# Altium schematic sheet Antenna & RF.SchDoc
size A4; SheetNumber: 2; SheetTotal: 2
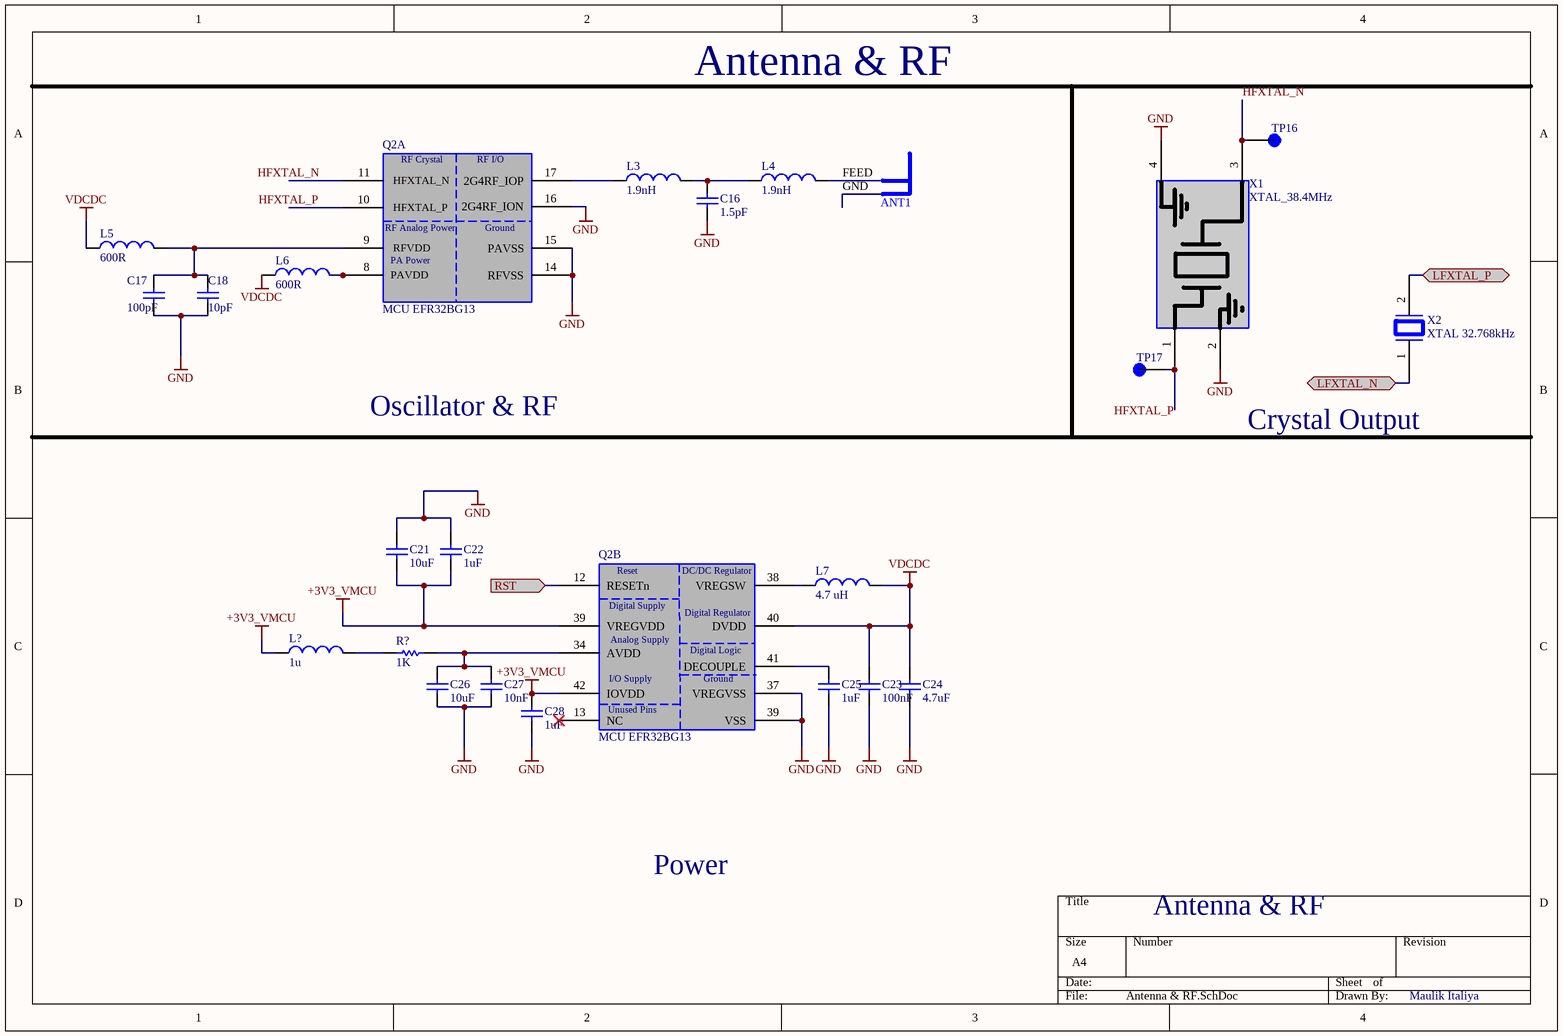
[diagram p0: Antenna & RF.SchDoc]

## Parts
C16  value 1.5pF  (hidden comment: Capacitor)
C17  value 100pF  (hidden comment: Capacitor)
C18  value 10pF  (hidden comment: Capacitor)
C21  value 10uF  (hidden comment: Capacitor)
C22  value 1uF  (hidden comment: Capacitor)
C23  value 100nF  (hidden comment: Capacitor)
C24  value 4.7uF  (hidden comment: Capacitor)
C25  value 1uF  (hidden comment: Capacitor)
C26  value 10uF  (hidden comment: Capacitor)
C27  value 10nF  (hidden comment: Capacitor)
C28  value 1uF  (hidden comment: Capacitor)
L3  value 1.9nH  (hidden comment: Inductor)
L4  value 1.9nH  (hidden comment: Inductor)
L5  value 600R  (hidden comment: Inductor)
L6  value 600R  (hidden comment: Inductor)
L7  value 4.7 uH  (hidden comment: Inductor)
L?  value 1u  (hidden comment: Inductor)
Q2A  MCU EFR32BG13
Q2B  MCU EFR32BG13
R?  value 1K  (hidden comment: Resistor)
TP16  (no value)  [KEYSTONE_5003]
TP17  (no value)  [KEYSTONE_5003]
X1  XTAL_38.4MHz
X2  XTAL 32.768kHz

## Ports
LFXTAL_N (bidir), LFXTAL_P (bidir), RST (in)

## Nets
+3V3_VMCU: C21.1 C22.1 C28.2 L?.1 Q2B.39(VREGVDD) Q2B.42(IOVDD)
GND: C16.1 C17.2 C18.2 C21.2 C22.2 C23.1 C24.1 C25.1 C26.1 C27.1 C28.1 Q2A.14(RFVSS) Q2A.15(PAVSS) Q2A.16(2G4RF_ION) Q2B.37(VREGVSS) Q2B.39(VSS) X1.2 X1.4
VDCDC: C23.2 C24.2 L5.1 L6.1 L7.2 Q2B.40(DVDD)
FEED: L4.2
HFXTAL_N: Q2A.11(HFXTAL_N) TP16.TP X1.3
HFXTAL_P: Q2A.10(HFXTAL_P) TP17.TP X1.1
LFXTAL_N: X2.1 ; port LFXTAL_N
LFXTAL_P: X2.2 ; port LFXTAL_P
RST: Q2B.12(RESETn) ; port RST
NetC16_2: C16.2 L3.2 L4.1
NetC17_1: C17.1 C18.1 L5.2 Q2A.9(RFVDD)
NetC25_2: C25.2 Q2B.41(DECOUPLE)
NetC26_2: C26.2 C27.2 Q2B.34(AVDD) R?.2
NetL3_1: L3.1 Q2A.17(2G4RF_IOP)
NetL6_2: L6.2 Q2A.8(PAVDD)
NetL7_1: L7.1 Q2B.38(VREGSW)
NetL?_2: L?.2 R?.1

Not connected (* = marked no-connect by the designer): Q2B 13(NC)*

## Notes on the sheet
- Antenna & RF
- Oscillator & RF
- Crystal Output
- Power
- Maulik Italiya
- Labels drawn without touching a wire or pin: ANT1
- (in symbol Q2A) RF Crystal; RF I/O; RF Analog Power; Ground; PA Power
- (in symbol Q2b) Reset; DC/DC Regulator; Digital Supply; Digital Regulator; Analog Supply; Digital Logic; I/O Supply; Ground; Unused Pins

## Library data of the parts
C16-C18 C21-C28 = Capacitor: SimulationGenericComponent: True
L3-L7 L? = Inductor: SimulationGenericComponent: True
Q2A = Q2A
Q2B = Q2b
R? = Resistor: TC1: 0; SimulationGenericComponent: True; TC2: 0
TP16 TP17 = 5003: Test Point Miniature THM H .300 Nylon 46 Insulated Orange PhosBronze/Silver | Keystone Electronics 5003; MF: Keystone Electronics Corp.; SnapEDA_Link: https://www.snapeda.com/parts/5003/Keystone/view-part/?ref=snap; Package: None; Value: *; MP: 5003; Check_prices: https://www.snapeda.com/parts/5003/Keystone/view-part/?ref=eda